# Altium project CMBus_Master.PrjPcb
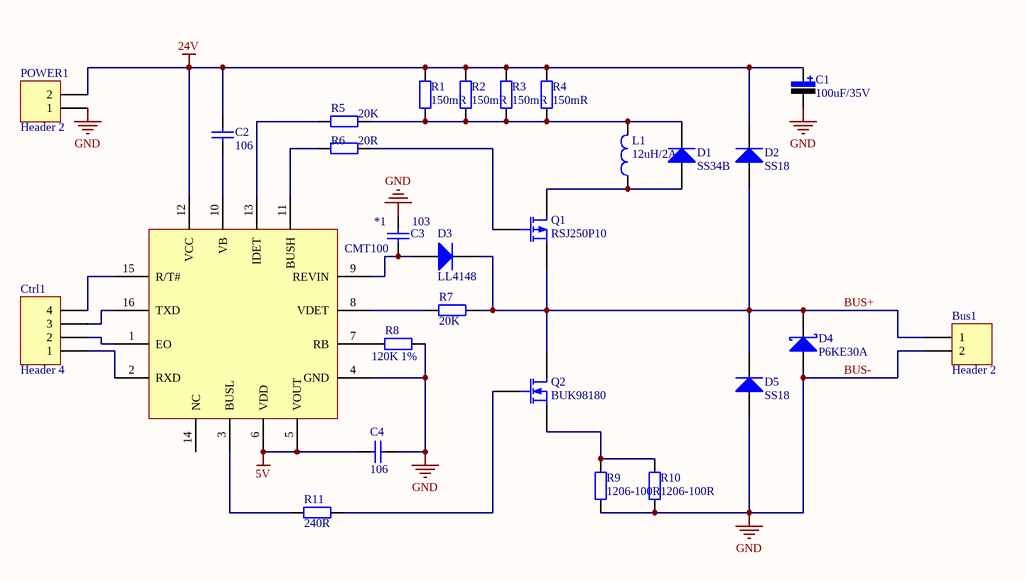
[diagram p0: Master_Sheet1.SchDoc]
1 sheet, 27 parts. Net scope: global (net labels, ports and power ports of the same name join across sheets).
Board file: Master_PCB1.PcbDoc

## Sheet Master_Sheet1.SchDoc
size A4

### Parts
*1  CMT100  [QFN-16]
Bus1  Header 2  [HDR1X2]
C1  value 100uF/35V  [C-RB-10]  (hidden comment: Cap Pol)
C2  value 106  [C-RAD-0805]  (hidden comment: Cap)
C3  value 103  [C-RAD-0805]  (hidden comment: Cap)
C4  value 106  [C-RAD-0805]  (hidden comment: Cap)
Ctrl1  Header 4  [HDR1X4]
D1  SS34B  [DIODE-SMA]
D2  SS18  [DIODE-SMA]
D3  LL4148  [DO-35]
D4  P6KE30A  [DO-15]
D5  SS18  [DIODE-SMA]
L1  value 12uH/2A  [L-RB-8]  (hidden comment: Inductor)
POWER1  Header 2  [HDR1X2]
Q1  RSJ250P10  [TO-220AB]
Q2  BUK98180  [TO-220AB]
R1  value 150mR  [0805-1]  (hidden comment: Res1)
R2  value 150mR  [0805-1]  (hidden comment: Res1)
R3  value 150mR  [0805-1]  (hidden comment: Res1)
R4  value 150mR  [0805-1]  (hidden comment: Res1)
R5  value 20K  [0805-1]  (hidden comment: Res1)
R6  value 20R  [0805-1]  (hidden comment: Res1)
R7  value 20K  [0805-1]  (hidden comment: Res1)
R8  value 120K 1%  [0805-1]  (hidden comment: Res1)
R9  value 1206-100R  [1206]  (hidden comment: Res1)
R10  value 1206-100R  [1206]  (hidden comment: Res1)
R11  value 240R  [0805-1]  (hidden comment: Res1)

### Nets
5V: *1.5(VOUT) *1.6(VDD) C4.1
24V: *1.12(VCC) C1.1 C2.2 D2.2(K) POWER1.2 R1.2 R2.2 R3.2 R4.2
BUS-: *1.4(GND) Bus1.2 C1.2 C3.2 C4.2 D4.2(K) D5.1(A) POWER1.1 R8.2 R9.1 R10.1  [also labelled GND]
BUS+: Bus1.1 D2.1(A) D3.2(K) D4.1(A) D5.2(K) Q1.S Q2.D R7.2
Net*1_1: *1.1(EO) Ctrl1.2
Net*1_2: *1.2(RXD) Ctrl1.1
Net*1_3: *1.3(BUSL) R11.1
Net*1_7: *1.7(RB) R8.1
Net*1_8: *1.8(VDET) R7.1
Net*1_9: *1.9(REVIN) C3.1 D3.1(A)
Net*1_10: *1.10(VB) C2.1
Net*1_11: *1.11(BUSH) R6.1
Net*1_13: *1.13(IDET) R5.1
Net*1_15: *1.15(R/T#) Ctrl1.4
Net*1_16: *1.16(TXD) Ctrl1.3
NetD1_1: D1.1(A) L1.1 Q1.D
NetD1_2: D1.2(K) L1.2 R1.1 R2.1 R3.1 R4.1 R5.2
NetQ1_G: Q1.G R6.2
NetQ2_G: Q2.G R11.2
NetQ2_S: Q2.S R9.2 R10.2

Not connected (* = marked no-connect by the designer): *1 14(NC)

### Library data of the parts
*1 = CMT100: 主机
Bus1 POWER1 = Header 2: Header, 2-Pin; LatestRevisionDate: 17-Jul-2002; LatestRevisionNote: Re-released for DXP Platform.; Publisher: Altium Limited
C1 = Cap Pol: 极性电解电容; Published: 8-Jun-2000; LatestRevisionDate: 17-Jul-2002; LatestRevisionNote: Re-released for DXP Platform.; PackageReference: RB7.6-15; Publisher: Altium Limited
C2-C4 = Cap: 无极性电容; Published: 8-Jun-2000; LatestRevisionDate: 17-Jul-2002; LatestRevisionNote: Re-released for DXP Platform.; PackageReference: RAD-0.3; Publisher: Altium Limited
Ctrl1 = Header 4: Header, 4-Pin; LatestRevisionDate: 17-Jul-2002; LatestRevisionNote: Re-released for DXP Platform.; Publisher: Altium Limited
D1-D3 D5 = Diode: Default Diode; Published: 8-Jun-2000; LatestRevisionDate: 17-Jul-2002; LatestRevisionNote: Re-released for DXP Platform.; PackageVersion: Sep-1996; PackageReference: SMC; Publisher: Altium Limited; PackageDescription: DO-214-AB/SMC; 2 C-Bend Leads; Body 7.9 x 5.9 mm, inc. leads (LxW); Code_JEDEC: DO-214-AB
D4 = Diode 18TQ045: Schottky Rectifier; Note: Terminal 2 is the TAB and is electrically connected to the cathode; Published: 8-Jun-2000; LatestRevisionDate: 17-Jul-2002; LatestRevisionNote: Re-released for DXP Platform.; DatasheetVersion: Dec-1997; PackageVersion: Feb-1998; PackageReference: TO-220AC; Publisher: Altium Limited; PackageDescription: TO, Thru-Hole, Vertical, Heatsink Mounted; 3 In-Line Leads (1 Absent); Pitch 2.54 mm; ComponentLink1Description: Manufacturer Link; ComponentLink1URL: http://www.irf.com/; ComponentLink2Description: Datasheet; ComponentLink2URL: http://www.irf.com/product-info/datasheets/data/18tq.pdf
L1 = Inductor: 电感; Code_IEC: 1005; Published: 8-Jun-2000; LatestRevisionDate: 17-Jul-2002; LatestRevisionNote: Re-released for DXP Platform.; PackageReference: 0402-A; Publisher: Altium Limited; Code_JEITA: 0402
Q1 = MOSFET-P: P-Channel MOSFET; Published: 8-Jun-2000; LatestRevisionDate: 17-Jul-2002; LatestRevisionNote: Re-released for DXP Platform.; PackageVersion: 1995/1996; PackageReference: E3; Publisher: Altium Limited; PackageDescription: TO, Flat Index; 3 In-Line, Axial Leads; Body Dia. 4.6mm; Lead Dia. 0.5 mm (max)
Q2 = MOSFET-N: N-Channel MOSFET; Published: 8-Jun-2000; LatestRevisionDate: 17-Jul-2002; LatestRevisionNote: Re-released for DXP Platform.; PackageVersion: 1995/1996; PackageReference: E3; Publisher: Altium Limited; PackageDescription: TO, Flat Index; 3 In-Line, Axial Leads; Body Dia. 4.6mm; Lead Dia. 0.5 mm (max)
R1-R11 = Res1: 贴片电阻; Published: 8-Jun-2000; LatestRevisionDate: 17-Jul-2002; LatestRevisionNote: Re-released for DXP Platform.; PackageReference: AXIAL-0.4; Publisher: Altium Limited